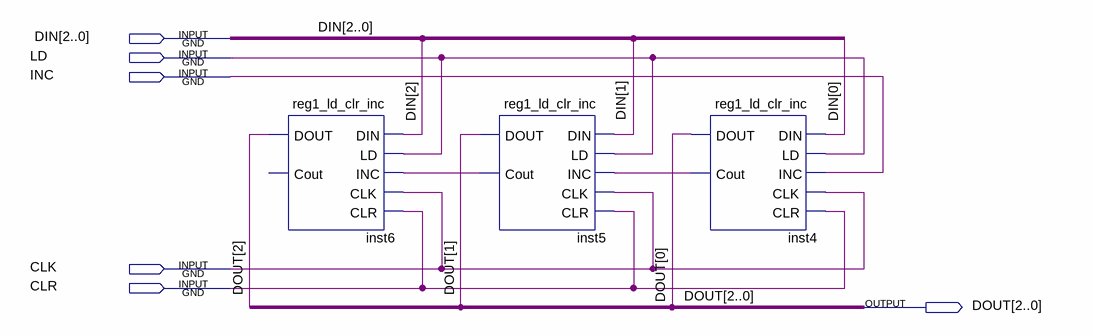
[diagram p0: schematic sheet]
// Quartus schematic reg3_ld_clr_inc.bdf as structural Verilog: 3 symbols, 6 pins
module reg3_ld_clr_inc (
  input  [2:0] DIN,
  input  LD,
  input  INC,
  input  CLK,
  input  CLR,
  output [2:0] DOUT
);

  wire inst4_cout, inst5_cout;

  reg1_ld_clr_inc inst6 (.DIN(DIN[2]), .LD(LD), .INC(inst5_cout), .CLK(CLK), .CLR(CLR), .DOUT(DOUT[2]));  // open: Cout
  reg1_ld_clr_inc inst5 (
    .DIN(DIN[1]), .LD(LD), .INC(inst4_cout), .CLK(CLK), .CLR(CLR), .DOUT(DOUT[1]), .Cout(inst5_cout));
  reg1_ld_clr_inc inst4 (.DIN(DIN[0]), .LD(LD), .INC(INC), .CLK(CLK), .CLR(CLR), .DOUT(DOUT[0]), .Cout(inst4_cout));
endmodule
